# EAGLE schematic stm32f030f4p6 (EAGLE 7.2.0)
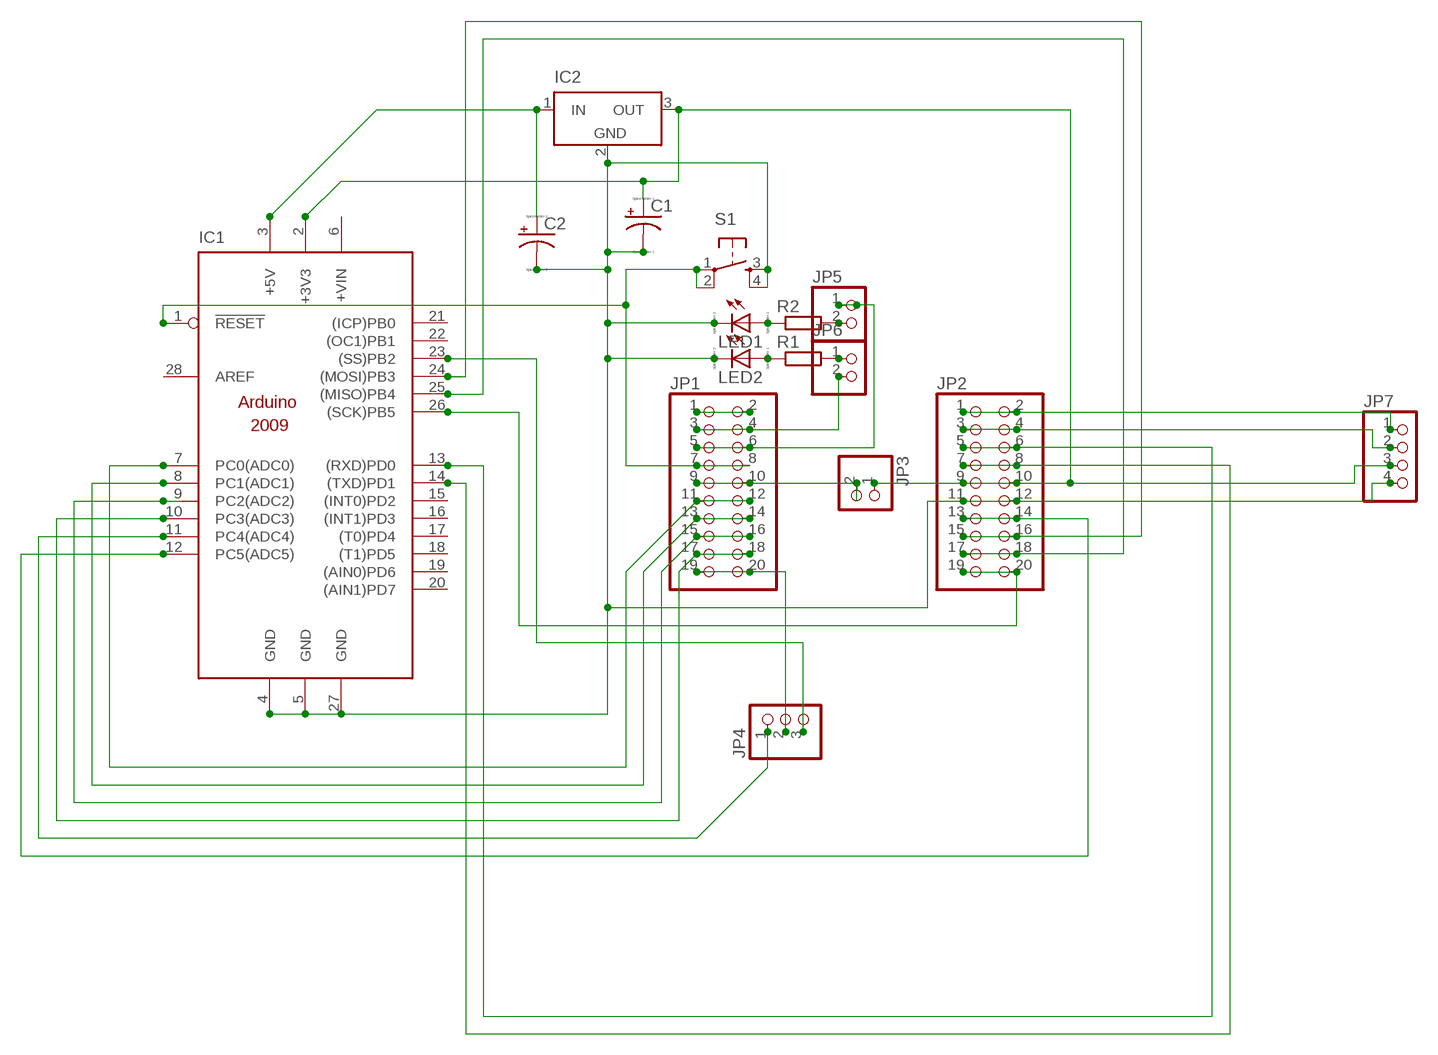
[diagram p0: schematic, sheet 1]

## Parts
C1  CPOL-USE3.5-8  [E3,5-8]
C2  CPOL-USE3.5-8  [E3,5-8]
IC1  ARDUINO2009_PIN_12  [ARDUINO2009_2]
IC2  LT1129CST5  [SOT223]
JP1  PINHD-2X10  [2X10]
JP2  PINHD-2X10  [2X10]
JP3  PINHD-1X2  [1X02]
JP4  PINHD-1X3_2.54  [1X03]
JP5  PINHD-1X2  [1X02]
JP6  PINHD-1X2  [1X02]
JP7  PINHD-1X4  [1X04]
LED1  LED_ELD260  [LED_LD260]
LED2  LED_ELD260  [LED_LD260]
R1  R-EU_0204/7  [0204/7]
R2  R-EU_0204/7  [0204/7]
S1  TAC_SWITCHPTH  [TACTILE-PTH]

## Nets
N$1: JP1.9 JP1.10 JP3.2
N$3: JP1.1 JP1.2
N$4: JP1.3 JP1.4 JP6.2
N$5: JP1.5 JP1.6 JP5.1
N$6: JP1.19 JP1.20 JP4.2
N$7: IC1.7(PC0(ADC0)) JP1.11 JP1.12
N$8: IC1.8(PC1(ADC1)) JP1.13 JP1.14
N$9: IC1.9(PC2(ADC2)) JP1.15 JP1.16
N$10: IC1.10(PC3(ADC3)) JP1.17 JP1.18
N$11: IC1.11(PC4(ADC4)) JP4.1
N$12: IC1.26((SCK)PB5) JP2.19 JP2.20
N$13: IC1.25((MISO)PB4) JP2.17 JP2.18
N$14: IC1.24((MOSI)PB3) JP2.15 JP2.16
N$15: IC1.12(PC5(ADC5)) JP2.13 JP2.14
N$17: IC1.14((TXD)PD1) JP2.7 JP2.8
N$18: IC1.13((RXD)PD0) JP2.5 JP2.6
N$19: JP2.3 JP2.4 JP7.2
N$20: JP2.1 JP2.2 JP7.1
N$21: IC1.1(!RESET) JP1.7 JP1.8 S1.1 S1.2
N$22: C1.- C2.- IC1.4(GND) IC1.5(GND) IC1.27(GND) IC2.2(GND) JP2.11 JP2.12 JP7.4 LED1.K(C) LED2.K(C) S1.3 S1.4
N$23: IC1.23((SS)PB2) JP4.3
N$24: C2.+ IC1.3(+5V) IC2.1(IN)
N$25: C1.+ IC1.2(+3V3) IC2.3(OUT) JP2.9 JP2.10 JP3.1 JP7.3
N$26: LED2.A R1.1
N$27: LED1.A R2.1
N$28: JP5.2 R2.2
N$29: JP6.1 R1.2
Unconnected: IC1.6(+VIN) IC1.15((INT0)PD2) IC1.16((INT1)PD3) IC1.17((T0)PD4) IC1.18((T1)PD5) IC1.19((AIN0)PD6) IC1.20((AIN1)PD7) IC1.21((ICP)PB0) IC1.22((OC1)PB1) IC1.28(AREF)

## Power pins joined to a net without a drawn wire
GND: IC2.4(GND)

## Library data of the parts
C1 C2 = resistor:CPOL-US: POLARIZED CAPACITOR, American symbol
IC1 = arduino:ARDUINO2009_PIN_1: The Arduino Duemilanove ("2009") is a microcontroller board based on the ATmega168 or ATmega328. - 14 digital input/output pins (of which 6 can be used as PWM outputs) - 6 analog inputs, a 16 MHz crystal oscillator - USB connection - power jack - ISP header - reset button It contains everything needed to support the microcontroller; simply connect it to a computer with a USB cable or power it with a AC-to-DC adapter or battery to get started http://arduino.cc/en/Main/ArduinoBoardDuemilanove
IC2 = linear-technology:LT1129CST5: VOLTAGE REGULATOR with shutdown; MPN: LT1129CST-5#PBF; OC_FARNELL: 1663375; OC_NEWARK: 57M2069
JP1 JP2 = pinhead:PINHD-2X10: PIN HEADER
JP3 JP5 JP6 = pinhead:PINHD-1X2: PIN HEADER
JP4 = pinhead-1:PINHD-1X3: PIN HEADER
JP7 = pinhead:PINHD-1X4: PIN HEADER
LED1 LED2 = eagle-ltspice:LED_E: LED Source: http://www.osram.convergy.de Source: www.luxeon.com Source: www.kingbright.com; SPICEMODEL: NONE; SPICEPREFIX: D; SPICETYPE: diode
R1 R2 = resistor:R-EU_: RESISTOR, European symbol
S1 = SparkFun:TAC_SWITCH: Momentary Switch Button commonly used for reset or general input. Spark Fun Electronics SKU : COM-00097